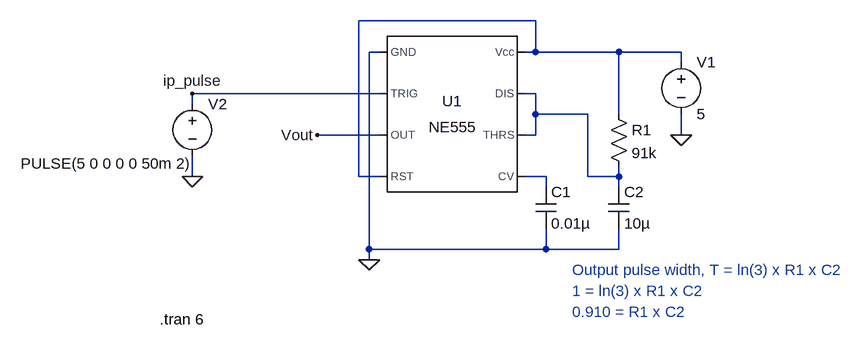
[diagram p0: schematic Monostablemv.asc]
Monostablemv.asc, the LTspice schematic file:
Version 4
SHEET 1 880 680
WIRE 320 32 48 32
WIRE 80 80 64 80
WIRE 320 80 320 32
WIRE 320 80 304 80
WIRE 448 80 320 80
WIRE 544 80 448 80
WIRE 544 96 544 80
WIRE 80 144 -208 144
WIRE 320 144 304 144
WIRE -208 160 -208 144
WIRE 320 176 320 144
WIRE 400 176 320 176
WIRE 448 176 448 80
WIRE 80 208 -16 208
WIRE 320 208 320 176
WIRE 320 208 304 208
WIRE 544 208 544 176
WIRE -208 272 -208 240
WIRE 48 272 48 32
WIRE 80 272 48 272
WIRE 336 272 304 272
WIRE 400 272 400 176
WIRE 448 272 448 256
WIRE 448 272 400 272
WIRE 336 288 336 272
WIRE 448 288 448 272
WIRE 64 384 64 80
WIRE 336 384 336 352
WIRE 336 384 64 384
WIRE 448 384 448 352
WIRE 448 384 336 384
WIRE 64 400 64 384
FLAG 544 208 0
FLAG 64 400 0
FLAG -208 144 ip_pulse
FLAG -16 208 Vout
FLAG -208 272 0
SYMBOL Misc\\NE555 192 176 R0
SYMATTR InstName U1
SYMBOL voltage 544 80 R0
WINDOW 123 0 0 Left 0
WINDOW 39 0 0 Left 0
SYMATTR InstName V1
SYMATTR Value 5
SYMBOL cap 320 288 R0
SYMATTR InstName C1
SYMATTR Value 0.01µ
SYMBOL res 432 160 R0
SYMATTR InstName R1
SYMATTR Value 91k
SYMBOL cap 432 288 R0
SYMATTR InstName C2
SYMATTR Value 10µ
SYMBOL voltage -208 144 R0
WINDOW 3 -264 108 Left 2
WINDOW 123 0 0 Left 0
WINDOW 39 0 0 Left 0
SYMATTR InstName V2
SYMATTR Value PULSE(5 0 0 0 0 50m 2)
TEXT 376 416 Left 2 ;Output pulse width, T = ln(3) x R1 x C2
TEXT 376 448 Left 2 ;1 = ln(3) x R1 x C2
TEXT 376 480 Left 2 ;0.910 = R1 x C2
TEXT -258 492 Left 2 !.tran 6

The netlist it stands for:
* Monostablemv.asc
XU1 0 ip_pulse Vout N001 N003 N002 N002 N001 NE555  ; pins GND TRIG OUT RST CV THRS DIS Vcc
V1 N001 0 5
C1 N003 0 0.01µ
R1 N001 N002 91k
C2 N002 0 10µ
V2 ip_pulse 0 PULSE(5 0 0 0 0 50m 2)
* Output pulse width, T = ln(3) x R1 x C2
* 1 = ln(3) x R1 x C2
* 0.910 = R1 x C2
.tran 6
.lib NE555.sub
.backanno
.end